# Altium schematic sheet CON_PS2MOUSE_MINIDIN6F.SchDoc: PS2 Mouse Connector
size A4; Organization: Altium Limited.; Address1: Level 3, 12a Rodborough Rd; Address2: Frenchs Forest 2086; Address3: NSW; Address4: AUSTRALIA; Revision: 6; SheetNumber: 20; SheetTotal: 64
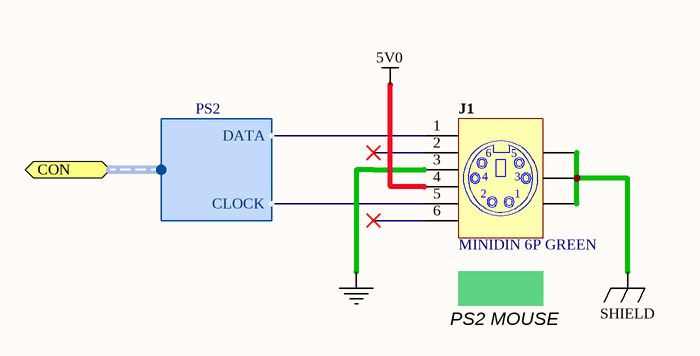
[diagram p0: CON_PS2MOUSE_MINIDIN6F.SchDoc]

## Parts
J1  MINIDIN 6P GREEN  [MINIDIN6GREEN]

## Ports
CON (harness PS2)

## Harnesses
PS2: DATA, CLOCK

## Nets
5V0: J1.4
GND: J1.3
SHIELD: J1.MH1 J1.MH2 J1.MH3
NetJ1_1: J1.1 ; port CON.DATA
NetJ1_5: J1.5 ; port CON.CLOCK

Not connected (* = marked no-connect by the designer): J1 2* 6*

## Notes on the sheet
- PS2 MOUSE
- Sheet Title
- Project Title
- Size:
- Date:
- A4
- Assy:
- Time:
- Sheet
- Revision:
- of
- File:

## Library data of the parts
J1 = D-300-0037: MINI-DIN R/A F/SHLD 6P GOLD PLATED--GREEN PC99 RoHS Compliant; Connector type: Header; Max Current: 2 A; Category: Connector; Mounting Technology: Through-Hole; Pin Count: 6; Status: Unreleased